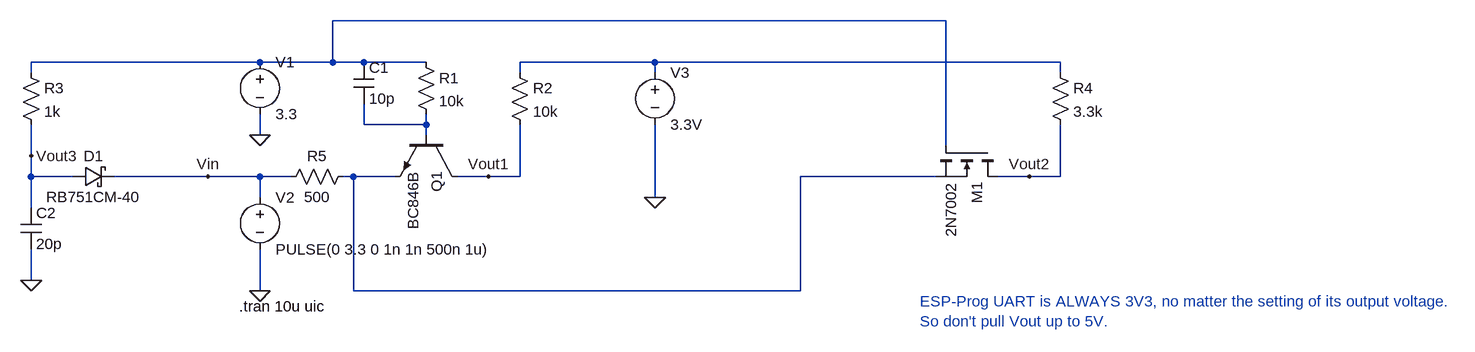
[diagram p0: schematic level_shifter.asc]
level_shifter.asc, the LTspice schematic file:
Version 4
SHEET 1 1864 680
WIRE 1024 -48 80 -48
WIRE -32 16 -384 16
WIRE 80 16 80 -48
WIRE 80 16 -32 16
WIRE 128 16 80 16
WIRE 224 16 128 16
WIRE 576 16 368 16
WIRE 1200 16 576 16
WIRE -384 32 -384 16
WIRE 368 32 368 16
WIRE 576 32 576 16
WIRE 1200 32 1200 16
WIRE 128 112 128 80
WIRE 224 112 224 96
WIRE 224 112 128 112
WIRE -32 128 -32 96
WIRE 224 128 224 112
WIRE 1024 144 1024 -48
WIRE -384 160 -384 112
WIRE -384 192 -384 160
WIRE -320 192 -384 192
WIRE -112 192 -256 192
WIRE -32 192 -112 192
WIRE 16 192 -32 192
WIRE 112 192 96 192
WIRE 176 192 112 192
WIRE 320 192 272 192
WIRE 368 192 368 112
WIRE 368 192 320 192
WIRE 1008 192 800 192
WIRE 1152 192 1104 192
WIRE 1200 192 1200 112
WIRE 1200 192 1152 192
WIRE -32 224 -32 192
WIRE 576 224 576 112
WIRE -384 240 -384 192
WIRE -384 352 -384 304
WIRE -32 368 -32 304
WIRE 112 368 112 192
WIRE 800 368 800 192
WIRE 800 368 112 368
FLAG -32 128 0
FLAG -32 368 0
FLAG 320 192 Vout1
FLAG 576 224 0
FLAG 1152 192 Vout2
FLAG -384 352 0
FLAG -384 160 Vout3
FLAG -112 192 Vin
SYMBOL npn 272 128 R90
SYMATTR InstName Q1
SYMATTR Value BC846B
SYMBOL res 208 0 R0
SYMATTR InstName R1
SYMATTR Value 10k
SYMBOL voltage -32 0 R0
WINDOW 123 0 0 Left 0
WINDOW 39 0 0 Left 0
SYMATTR InstName V1
SYMATTR Value 3.3
SYMBOL res 352 16 R0
SYMATTR InstName R2
SYMATTR Value 10k
SYMBOL voltage -32 208 R0
WINDOW 123 0 0 Left 0
WINDOW 39 0 0 Left 0
SYMATTR InstName V2
SYMATTR Value PULSE(0 3.3 0 1n 1n 500n 1u)
SYMBOL voltage 576 16 R0
WINDOW 123 0 0 Left 0
WINDOW 39 0 0 Left 0
SYMATTR InstName V3
SYMATTR Value 3.3V
SYMBOL res 1184 16 R0
SYMATTR InstName R4
SYMATTR Value 3.3k
SYMBOL nmos 1104 144 R90
SYMATTR InstName M1
SYMATTR Value 2N7002
SYMBOL schottky -320 208 R270
WINDOW 0 32 32 VTop 2
WINDOW 3 0 32 VBottom 2
SYMATTR InstName D1
SYMATTR Value RB751CM-40
SYMATTR Description Diode
SYMATTR Type diode
SYMBOL res -400 16 R0
SYMATTR InstName R3
SYMATTR Value 1k
SYMBOL cap -400 240 R0
SYMATTR InstName C2
SYMATTR Value 20p
SYMBOL res 112 176 R90
WINDOW 0 0 56 VBottom 2
WINDOW 3 32 56 VTop 2
SYMATTR InstName R5
SYMATTR Value 500
SYMBOL cap 112 16 R0
SYMATTR InstName C1
SYMATTR Value 10p
TEXT -64 392 Left 2 !.tran 10u uic
TEXT 984 384 Left 2 ;ESP-Prog UART is ALWAYS 3V3, no matter the setting of its output voltage. \nSo don't pull Vout up to 5V.

The netlist it stands for:
* level_shifter.asc
Q1 Vout1 N003 N004 0 BC846B
R1 N001 N003 10k
V1 N001 0 3.3
R2 N002 Vout1 10k
V2 Vin 0 PULSE(0 3.3 0 1n 1n 500n 1u)
V3 N002 0 3.3V
R4 N002 Vout2 3.3k
M1 Vout2 N001 N004 N004 2N7002
D1 Vout3 Vin RB751CM-40
R3 N001 Vout3 1k
C2 Vout3 0 20p
R5 N004 Vin 500
C1 N001 N003 10p
.model D D
.lib standard.dio
.model NPN NPN
.model PNP PNP
.lib standard.bjt
.model NMOS NMOS
.model PMOS PMOS
.lib standard.mos
.tran 10u uic
* ESP-Prog UART is ALWAYS 3V3, no matter the setting of its output voltage.
* So don't pull Vout up to 5V.
.backanno
.end